# EAGLE design KeypadNut (EAGLE 7.3.0)
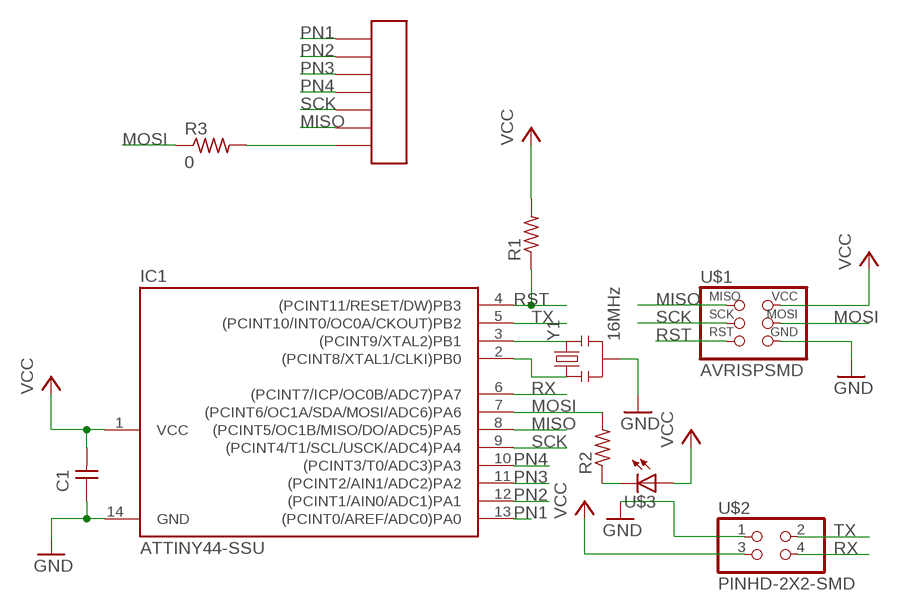
[diagram p0: schematic, sheet 1]

## Parts
C1  UNPOLARIZED_CAPACITOR1206  [1206]
IC1  ATTINY44-SSU  [SOIC14]
R1  RESISTOR1206  [1206]
R2  RESISTOR1206  [1206]
R3  0  RESISTOR1206  [1206]
U$1  AVRISPSMD  [2X03SMD]
U$2  PINHD-2X2-SMD  [2X02SMD]
U$3  LED1206  [1206]
U$4  1X07-HEADER  [1X07-SMD]
Y1  16MHz  RESONATOR16MHZ  [RESONATOR-SMD]

## Nets
GND: C1.1 IC1.14(GND) U$1.6(GND) U$2.1 Y1.2
MISO: IC1.8((PCINT5/OC1B/MISO/DO/ADC5)PA5) U$1.1(MISO) U$4.6
MOSI: IC1.7((PCINT6/OC1A/SDA/MOSI/ADC6)PA6) R2.2 R3.1 U$1.4(MOSI)
N$1: IC1.2((PCINT8/XTAL1/CLKI)PB0) Y1.1
N$2: IC1.3((PCINT9/XTAL2)PB1) Y1.3
N$3: R2.1 U$3.2(C)
N$4: R3.2 U$4.7
PN1: IC1.13((PCINT0/AREF/ADC0)PA0) U$4.1
PN2: IC1.12((PCINT1/AIN0/ADC1)PA1) U$4.2
PN3: IC1.11((PCINT2/AIN1/ADC2)PA2) U$4.3
PN4: IC1.10((PCINT3/T0/ADC3)PA3) U$4.4
RST: IC1.4((PCINT11/RESET/DW)PB3) R1.1 U$1.5(RST)
RX: IC1.6((PCINT7/ICP/OC0B/ADC7)PA7) U$2.4
SCK: IC1.9((PCINT4/T1/SCL/USCK/ADC4)PA4) U$1.3(SCK) U$4.5
TX: IC1.5((PCINT10/INT0/OC0A/CKOUT)PB2) U$2.2
VCC: C1.2 IC1.1(VCC) R1.2 U$1.2(VCC) U$2.3 U$3.1(A)

## Library data of the parts
C1 = fabPatil:UNPOLARIZED_CAPACITOR: unpolarized_capacitor
IC1 = fabPatil:ATTINY44
R1 R2 = fabPatil:RESISTOR
R3 = fablab:RESISTOR
U$1 = fabPatil:AVRISP
U$2 = fabPatil:PINHD-2X2-SMD
U$3 = fabPatil:LED
U$4 = fablab:1X07-HEADER
Y1 = fabPatil:RESONATOR: Resonator Small SMD resonator. Used, eg, on the Arduino Pro/ Pro Mini boards. 8MHz- XTAL-08895 16MHz- XTAL-08900; PROD_ID: XTAL-08900

## Board
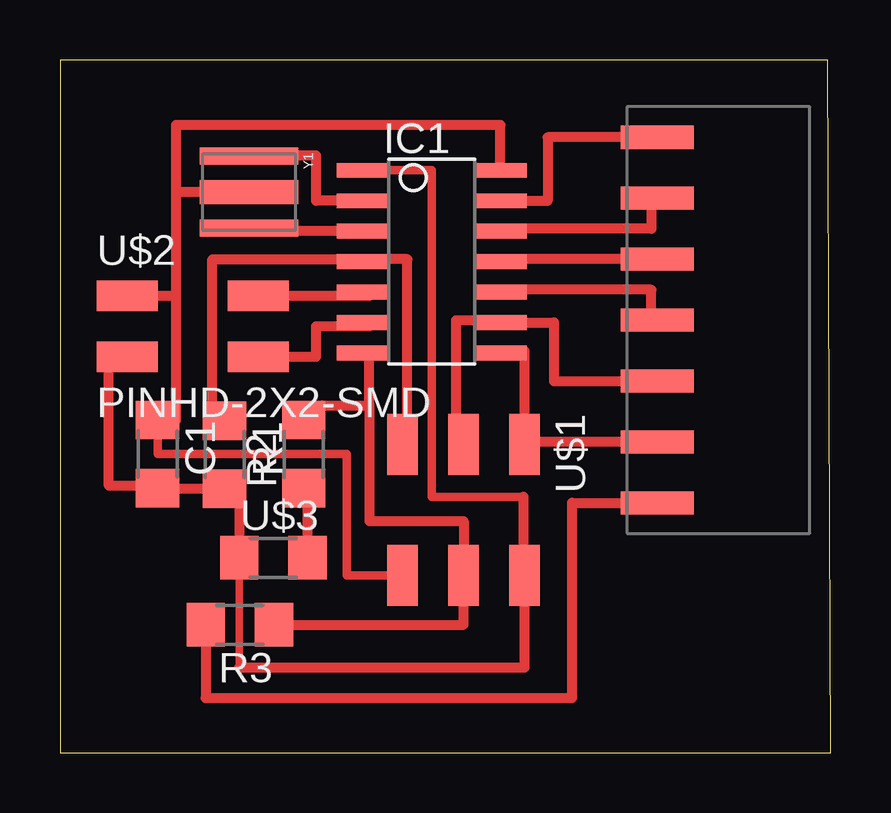
[diagram p1: board, top side]
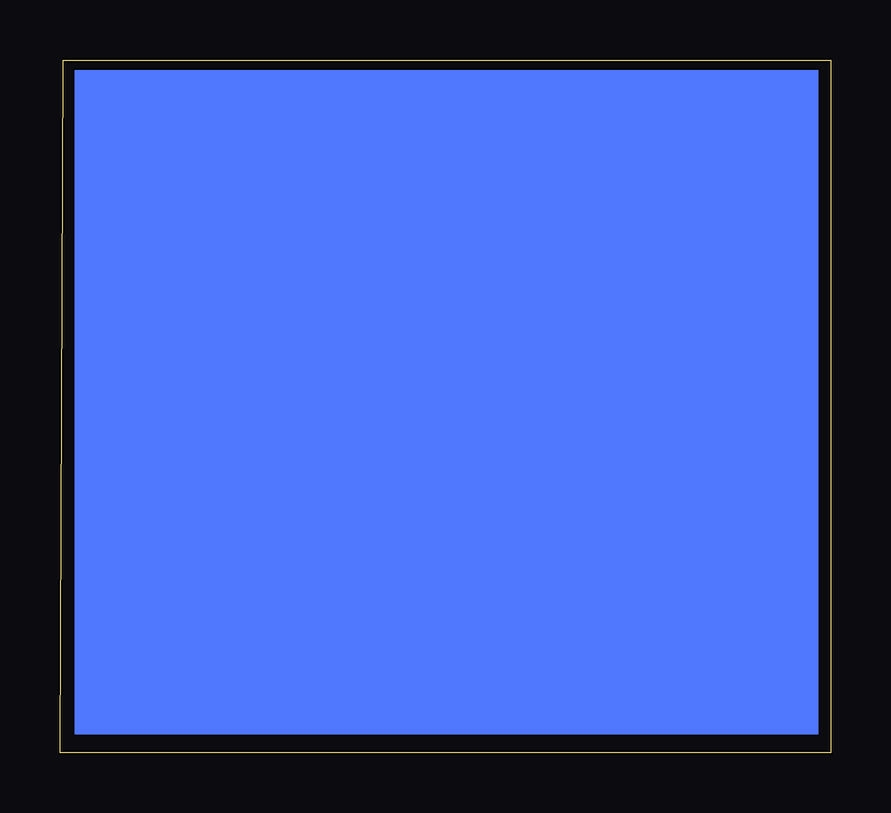
[diagram p2: board, bottom side, seen from below]

Size 32.11 x 28.88 mm. Coordinates in mm from the lower left corner, seen from the top.
Outline: 0,0 32.11,0 31.98,28.88 0,28.88 0,0
Copper layers (1*16): Top 0.035mm / dielectric 1.5mm / Bottom 0.035mm
Design rules "Patil": minimum track width 10mil, minimum drill 24mil, track to track 16mil, track to pad 16mil, pad to pad 16mil, via to via 16mil, smd to smd 16mil, copper to edge 40mil, drill to drill 8mil, minimum pad ring 10mil, minimum via ring 8mil, stop-mask expansion 4mil, vias tented up to drill 0mil, thermal gap 10mil

### Footprints (pad centres in the part's own frame; a part is rotated, then mirrored left to right if it is on the bottom)
1206 = smd 1.6 x 1.803: 1 -1.422,0; 2 1.422,0
SOIC14 = smd 0.61 x 2.21: 1 -3.81,-2.857; 2 -2.54,-2.857; 3 -1.27,-2.857; 4 0,-2.857; 5 1.27,-2.857; 6 2.54,-2.857; 7 3.81,-2.857; 8 3.81,2.857; 9 2.54,2.857; 10 1.27,2.857; 11 0,2.857; 12 -1.27,2.857; 13 -2.54,2.857; 14 -3.81,2.857
2X03SMD = smd 2.54 x 1.27: 1 -2.54,2.54; 2 2.92,2.54; 3 -2.54,0; 4 2.92,0; 5 -2.54,-2.54; 6 2.92,-2.54
2X02SMD = smd 2.54 x 1.27: 1 -2.54,1.27; 2 2.92,1.27; 3 -2.54,-1.27; 4 2.92,-1.27
1X07-SMD = smd 0.965 x 3.048: 1 7.62,3.81; 2 5.08,3.81; 3 2.54,3.81; 4 0,3.81; 5 -2.54,3.81; 6 -5.08,3.81; 7 -7.62,3.81
RESONATOR-SMD = smd 0.7 x 4.1: 1 -1.5,0; 3 1.5,0 | smd 1 x 4.1: 2 0,0

### Placement (x,y rotation side)
C1  4.06,12.45 270 top
IC1  15.49,20.47 270 top
R1  6.86,12.42 270 top
R2  10.16,12.45 90 top
R3  7.49,5.33 180 top
U$1  16.81,10.31 270 top
U$2  5.33,17.78 0 top
U$3  8.89,8.13 0 top
U$4  28.7,18.03 90 top
Y1  7.87,23.37 270 top

### Tracks (layer width: path | path; a pad name or v marks a point on that pad's centre or on a via)
GND
  Top 0.356: U$1.6 11.94,7.39 11.94,12.45 4.06,12.45 C1.1
  Top 0.406: IC1.14 18.35,26.16 4.83,26.16 4.83,23.37 | Y1.2 4.83,23.37 | 4.83,23.37 4.83,19.05 | U$2.1 4.83,19.05 | 4.83,19.05 4.83,13.87 C1.1
MISO
  Top 0.406: U$1.1 19.36,16.76 19.05,16.76 19.05,16.66 IC1.8 | 19.36,13.46 U$1.1 | U$4.6 19.36,12.95 U$1.1
MOSI
  Top 0.406: 12.89,14.48 12.89,9.65 16.82,9.65 U$1.4 16.82,5.33 R3.1 | R2.2 10.92,14.48 12.89,14.48 | 12.89,14.48 12.89,16.66 IC1.7
N$1
  Top 0.406: IC1.2 10.67,23.01 10.67,24.89 7.87,24.89 Y1.1
N$2
  Top 0.406: IC1.3 7.87,21.74 Y1.3
N$3
  Top 0.406: R2.1 10.31,11.02 U$3.2
N$4
  Top 0.406: R3.2 6.07,2.29 21.34,2.29 21.34,10.41 U$4.7
PN1
  Top 0.406: IC1.13 20.32,23.01 20.32,25.65 U$4.1
PN2
  Top 0.406: U$4.2 24.64,23.11 24.64,21.84 18.35,21.84 IC1.12
PN3
  Top 0.406: U$4.3 18.35,20.57 IC1.11
PN4
  Top 0.406: U$4.4 24.64,18.03 24.64,19.3 18.35,19.3 IC1.10
RST
  Top 0.254: 13.04,20.32 IC1.4
  Top 0.406: R1.1 6.35,13.97 6.35,20.57 12.89,20.57 IC1.4 12.64,20.57 14.48,20.57 14.48,12.85 U$1.5
RX
  Top 0.406: U$2.4 10.67,16.51 10.67,17.78 12.89,17.78 IC1.6
SCK
  Top 0.406: U$1.3 16.51,12.85 16.51,18.03 18.35,18.03 IC1.9 20.57,17.93 20.57,15.49 U$4.5
TX
  Top 0.406: U$2.2 12.89,19.05 IC1.5
VCC
  Top 0.254: 19.3,7.39 U$1.2
  Top 0.305: U$3.1 7.47,3.56
  Top 0.356: IC1.1 15.49,24.28 15.49,10.67 19.3,10.67
  Top 0.406: 19.3,10.67 19.3,7.39 | 7.47,3.56 7.62,3.56 19.36,3.56 U$1.2 | U$3.1 7.47,11.13 R1.2 6.86,11.02 C1.2 4.06,11.13 2.03,11.13 2.03,16.51 U$2.3
(copper drawn outside any net)
  shapes: Bottom area x1